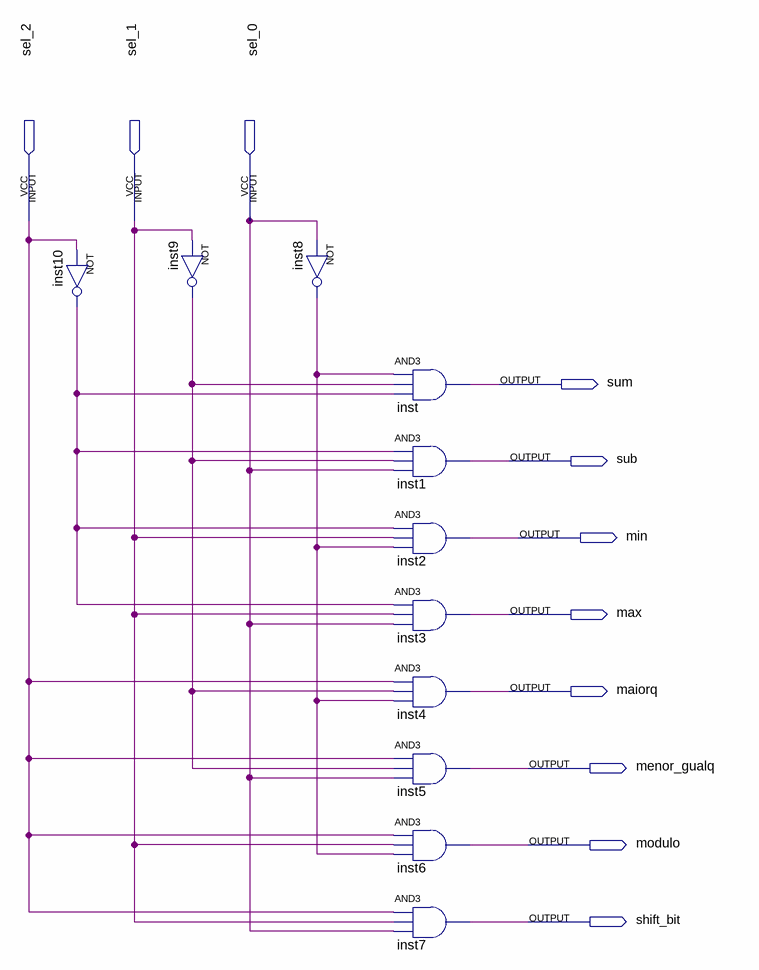
[diagram p0: schematic sheet]
// Quartus schematic decodificador_3_para_8.bdf as structural Verilog: 11 symbols, 11 pins
module decodificador_3_para_8 (
  input  sel_2,
  input  sel_1,
  input  sel_0,
  output sum,
  output sub,
  output min,
  output max,
  output maiorq,
  output menor_gualq,
  output modulo,
  output shift_bit
);

  wire inst8_out, inst9_out, inst10_out;

  not inst10 (inst10_out, sel_2);
  not inst9 (inst9_out, sel_1);
  not inst8 (inst8_out, sel_0);
  and inst (sum, inst8_out, inst9_out, inst10_out);
  and inst1 (sub, inst10_out, inst9_out, sel_0);
  and inst2 (min, inst10_out, sel_1, inst8_out);
  and inst3 (max, inst10_out, sel_1, sel_0);
  and inst4 (maiorq, sel_2, inst9_out, inst8_out);
  and inst5 (menor_gualq, sel_2, inst9_out, sel_0);
  and inst6 (modulo, sel_2, sel_1, inst8_out);
  and inst7 (shift_bit, sel_2, sel_1, sel_0);
endmodule
